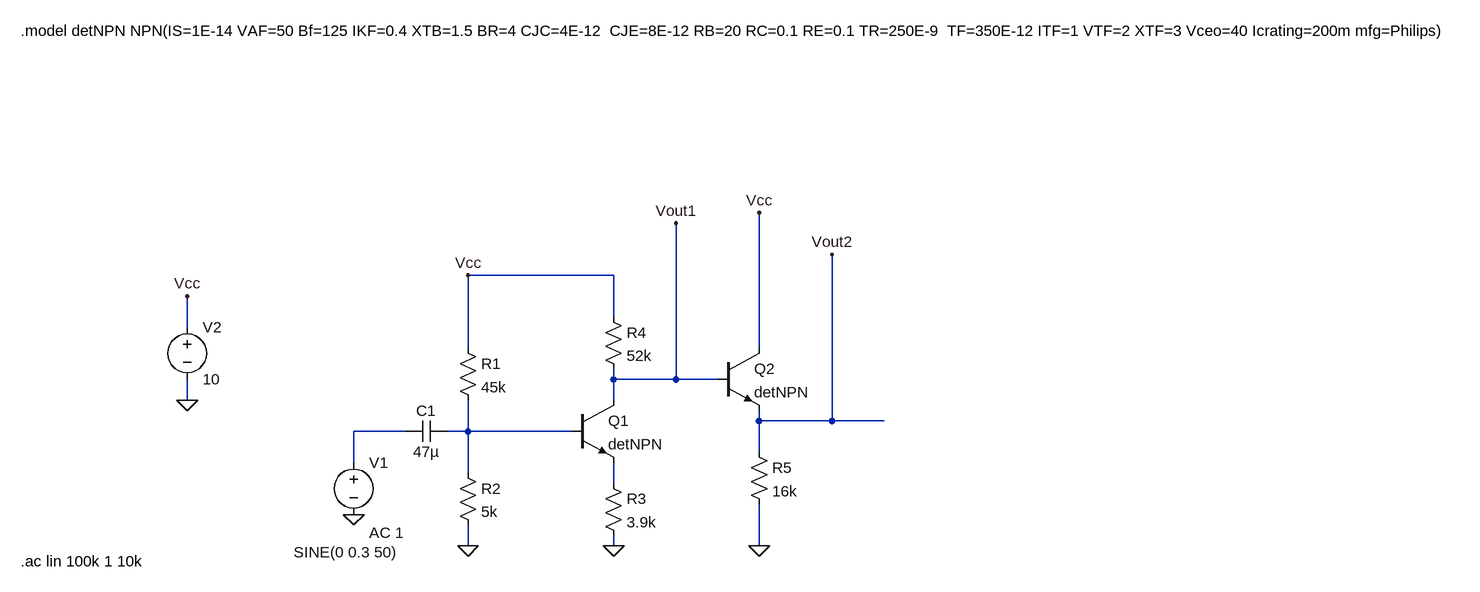
[diagram p0: schematic amplifier.asc]
amplifier.asc, the LTspice schematic file:
Version 4
SHEET 1 2036 868
WIRE 576 192 352 192
WIRE 576 256 576 192
WIRE -80 272 -80 224
WIRE 352 304 352 192
WIRE 800 304 800 96
WIRE 576 352 576 336
WIRE 672 352 672 112
WIRE 672 352 576 352
WIRE 736 352 672 352
WIRE -80 384 -80 352
WIRE 576 384 576 352
WIRE 800 416 800 400
WIRE 912 416 912 160
WIRE 912 416 800 416
WIRE 992 416 912 416
WIRE 256 432 176 432
WIRE 352 432 352 384
WIRE 352 432 320 432
WIRE 512 432 352 432
WIRE 800 464 800 416
WIRE 176 480 176 432
WIRE 352 496 352 432
WIRE 576 512 576 480
WIRE 352 608 352 576
WIRE 576 608 576 592
WIRE 800 608 800 544
FLAG 176 560 0
FLAG 352 608 0
FLAG -80 224 Vcc
FLAG -80 384 0
FLAG 352 192 Vcc
FLAG 576 608 0
FLAG 672 112 Vout1
FLAG 800 608 0
FLAG 800 96 Vcc
FLAG 912 160 Vout2
SYMBOL voltage 176 464 R0
WINDOW 3 -92 154 Left 2
WINDOW 123 24 124 Left 2
WINDOW 39 0 0 Left 0
SYMATTR Value SINE(0 0.3 50)
SYMATTR Value2 AC 1
SYMATTR InstName V1
SYMBOL cap 320 416 R90
WINDOW 0 0 32 VBottom 2
WINDOW 3 32 32 VTop 2
SYMATTR InstName C1
SYMATTR Value 47µ
SYMBOL npn 512 384 R0
SYMATTR InstName Q1
SYMATTR Value detNPN
SYMBOL res 336 288 R0
SYMATTR InstName R1
SYMATTR Value 45k
SYMBOL res 336 480 R0
SYMATTR InstName R2
SYMATTR Value 5k
SYMBOL voltage -80 256 R0
WINDOW 123 0 0 Left 0
WINDOW 39 0 0 Left 0
SYMATTR InstName V2
SYMATTR Value 10
SYMBOL res 560 496 R0
SYMATTR InstName R3
SYMATTR Value 3.9k
SYMBOL res 560 240 R0
SYMATTR InstName R4
SYMATTR Value 52k
SYMBOL npn 736 304 R0
SYMATTR InstName Q2
SYMATTR Value detNPN
SYMBOL res 784 448 R0
SYMATTR InstName R5
SYMATTR Value 16k
TEXT -336 -184 Left 2 !.model detNPN NPN(IS=1E-14 VAF=50 Bf=125 IKF=0.4 XTB=1.5 BR=4 CJC=4E-12  CJE=8E-12 RB=20 RC=0.1 RE=0.1 TR=250E-9  TF=350E-12 ITF=1 VTF=2 XTF=3 Vceo=40 Icrating=200m mfg=Philips)
TEXT -336 632 Left 2 !.ac lin 100k 1 10k

The netlist it stands for:
* amplifier.asc
V1 N001 0 SINE(0 0.3 50) AC 1
C1 N002 N001 47µ
Q1 Vout1 N002 N003 0 detNPN
R1 Vcc N002 45k
R2 N002 0 5k
V2 Vcc 0 10
R3 N003 0 3.9k
R4 Vcc Vout1 52k
Q2 Vcc Vout1 Vout2 0 detNPN
R5 Vout2 0 16k
.model NPN NPN
.model PNP PNP
.lib standard.bjt
.model detNPN NPN(IS=1E-14 VAF=50 Bf=125 IKF=0.4 XTB=1.5 BR=4 CJC=4E-12  CJE=8E-12 RB=20 RC=0.1 RE=0.1 TR=250E-9  TF=350E-12 ITF=1 VTF=2 XTF=3 Vceo=40 Icrating=200m mfg=Philips)
.ac lin 100k 1 10k
.backanno
.end